# EAGLE design solenoid valve2 2019:9:15 (EAGLE 9.2.2)

## Sheet 1 of 5: photorelay0
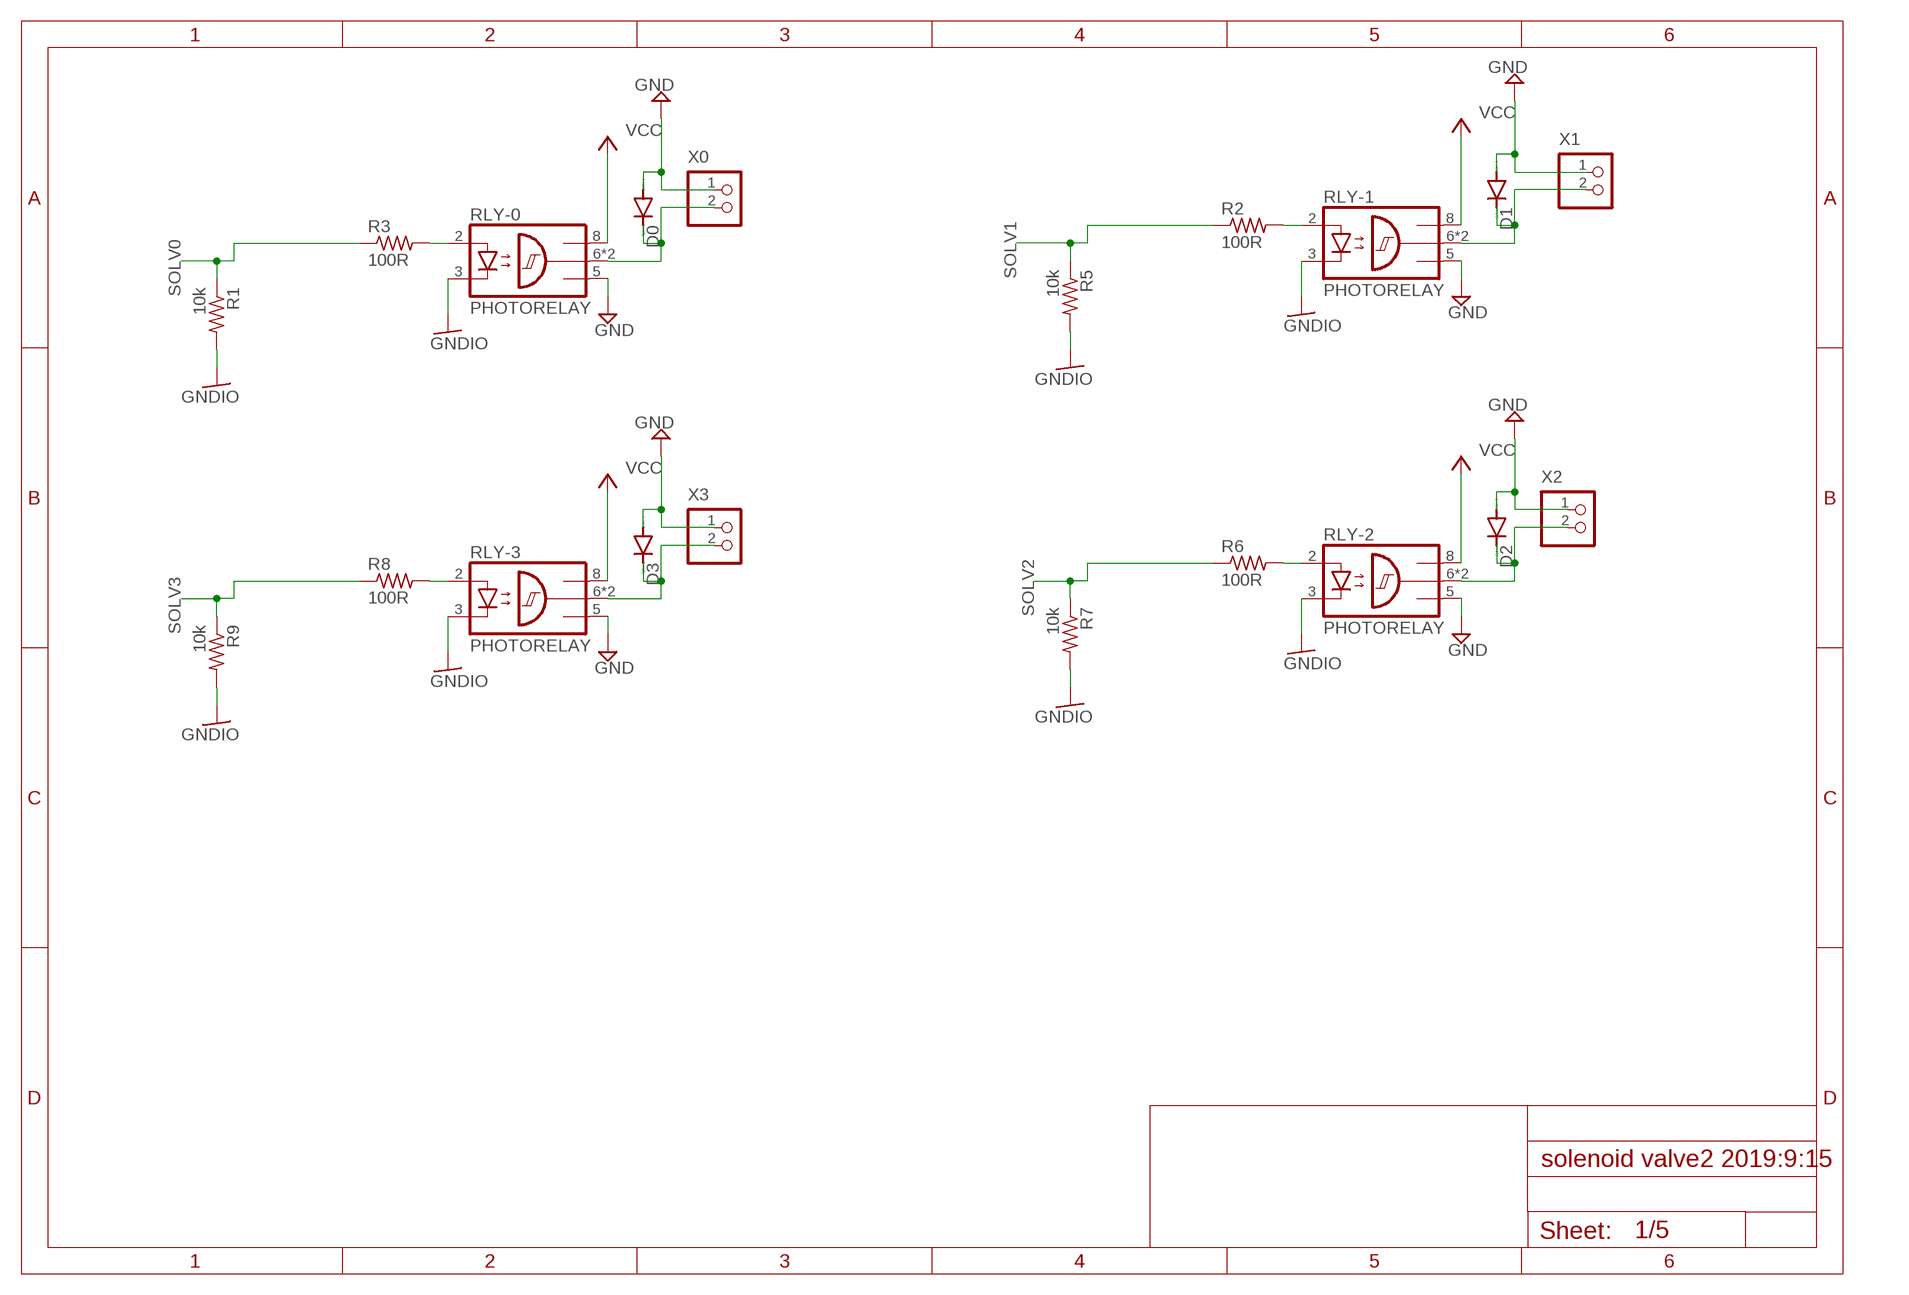
[diagram p0: schematic, sheet 1]

### Parts
D0  DIODE-SOD123  [SOD123]
D1  DIODE-SOD123  [SOD123]
D2  DIODE-SOD123  [SOD123]
D3  DIODE-SOD123  [SOD123]
R1  10k  R-US_R0603  [R0603]
R2  100R  R-US_R0603  [R0603]
R3  100R  R-US_R0603  [R0603]
R5  10k  R-US_R0603  [R0603]
R6  100R  R-US_R0603  [R0603]
R7  10k  R-US_R0603  [R0603]
R8  100R  R-US_R0603  [R0603]
R9  10k  R-US_R0603  [R0603]
RLY-0  PHOTORELAY  [SOP254P1016X385-8]
RLY-1  PHOTORELAY  [SOP254P1016X385-8]
RLY-2  PHOTORELAY  [SOP254P1016X385-8]
RLY-3  PHOTORELAY  [SOP254P1016X385-8]
X0  S2B-XASK-1  [S2B-XASK-1]
X1  S2B-XASK-1  [S2B-XASK-1]
X2  S2B-XASK-1  [S2B-XASK-1]
X3  S2B-XASK-1  [S2B-XASK-1]

### Nets
GND: D0.A D1.A D2.A D3.A RLY-0.5(GND) RLY-1.5(GND) RLY-2.5(GND) RLY-3.5(GND) X0.1 X1.1 X2.1 X3.1 ; also sheet 2
GNDIO: R1.2 R5.2 R7.2 R9.2 RLY-0.3(C) RLY-1.3(C) RLY-2.3(C) RLY-3.3(C) ; also sheet 2,3,4,5
N$1: D1.C RLY-1.6(OUT) RLY-1.7(OUT) X1.2
N$2: R2.2 RLY-1.2(A)
N$3: D0.C RLY-0.6(OUT) RLY-0.7(OUT) X0.2
N$5: D2.C RLY-2.6(OUT) RLY-2.7(OUT) X2.2
N$6: R3.2 RLY-0.2(A)
N$8: R6.2 RLY-2.2(A)
N$23: D3.C RLY-3.6(OUT) RLY-3.7(OUT) X3.2
N$24: R8.2 RLY-3.2(A)
SOLV0: R1.1 R3.1 ; also sheet 3
SOLV1: R2.1 R5.1 ; also sheet 3
SOLV2: R6.1 R7.1 ; also sheet 3
SOLV3: R8.1 R9.1 ; also sheet 3
VCC: RLY-0.8(VCC) RLY-1.8(VCC) RLY-2.8(VCC) RLY-3.8(VCC) ; also sheet 2

## Sheet 2 of 5: photorelay1
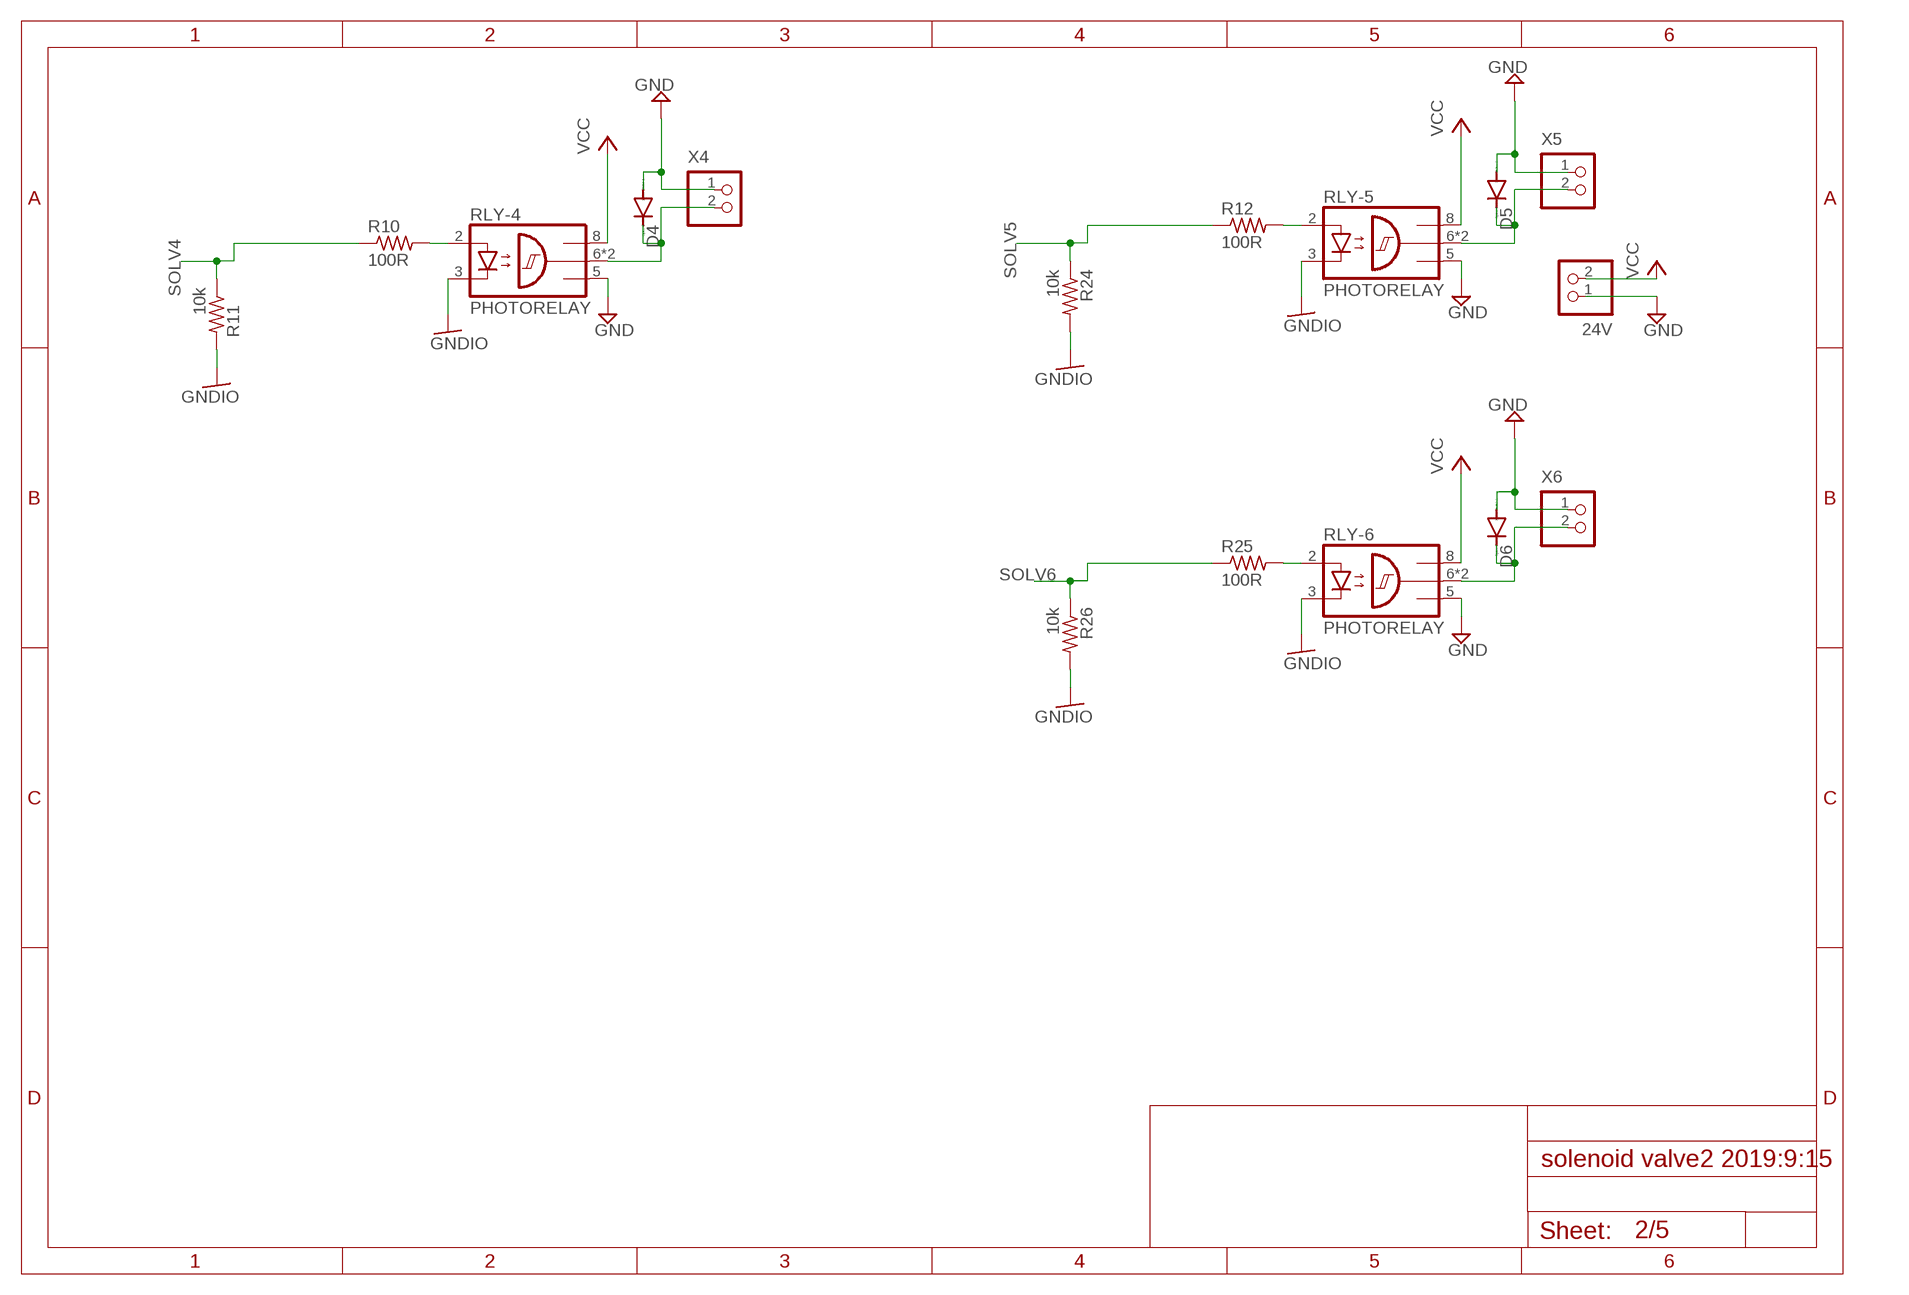
[diagram p1: schematic, sheet 2]

### Parts
24V  S2B-XASK-1  [S2B-XASK-1]
D4  DIODE-SOD123  [SOD123]
D5  DIODE-SOD123  [SOD123]
D6  DIODE-SOD123  [SOD123]
R10  100R  R-US_R0603  [R0603]
R11  10k  R-US_R0603  [R0603]
R12  100R  R-US_R0603  [R0603]
R24  10k  R-US_R0603  [R0603]
R25  100R  R-US_R0603  [R0603]
R26  10k  R-US_R0603  [R0603]
RLY-4  PHOTORELAY  [SOP254P1016X385-8]
RLY-5  PHOTORELAY  [SOP254P1016X385-8]
RLY-6  PHOTORELAY  [SOP254P1016X385-8]
X4  S2B-XASK-1  [S2B-XASK-1]
X5  S2B-XASK-1  [S2B-XASK-1]
X6  S2B-XASK-1  [S2B-XASK-1]

### Nets
GND: 24V.1 D4.A D5.A D6.A RLY-4.5(GND) RLY-5.5(GND) RLY-6.5(GND) X4.1 X5.1 X6.1 ; also sheet 1
GNDIO: R11.2 R24.2 R26.2 RLY-4.3(C) RLY-5.3(C) RLY-6.3(C) ; also sheet 1,3,4,5
N$26: D4.C RLY-4.6(OUT) RLY-4.7(OUT) X4.2
N$27: R10.2 RLY-4.2(A)
N$29: D5.C RLY-5.6(OUT) RLY-5.7(OUT) X5.2
N$30: R12.2 RLY-5.2(A)
N$32: D6.C RLY-6.6(OUT) RLY-6.7(OUT) X6.2
N$33: R25.2 RLY-6.2(A)
SOLV4: R10.1 R11.1 ; also sheet 3
SOLV5: R12.1 R24.1 ; also sheet 3
SOLV6: R25.1 R26.1 ; also sheet 3
VCC: 24V.2 RLY-4.8(VCC) RLY-5.8(VCC) RLY-6.8(VCC) ; also sheet 1

## Sheet 3 of 5: mcu
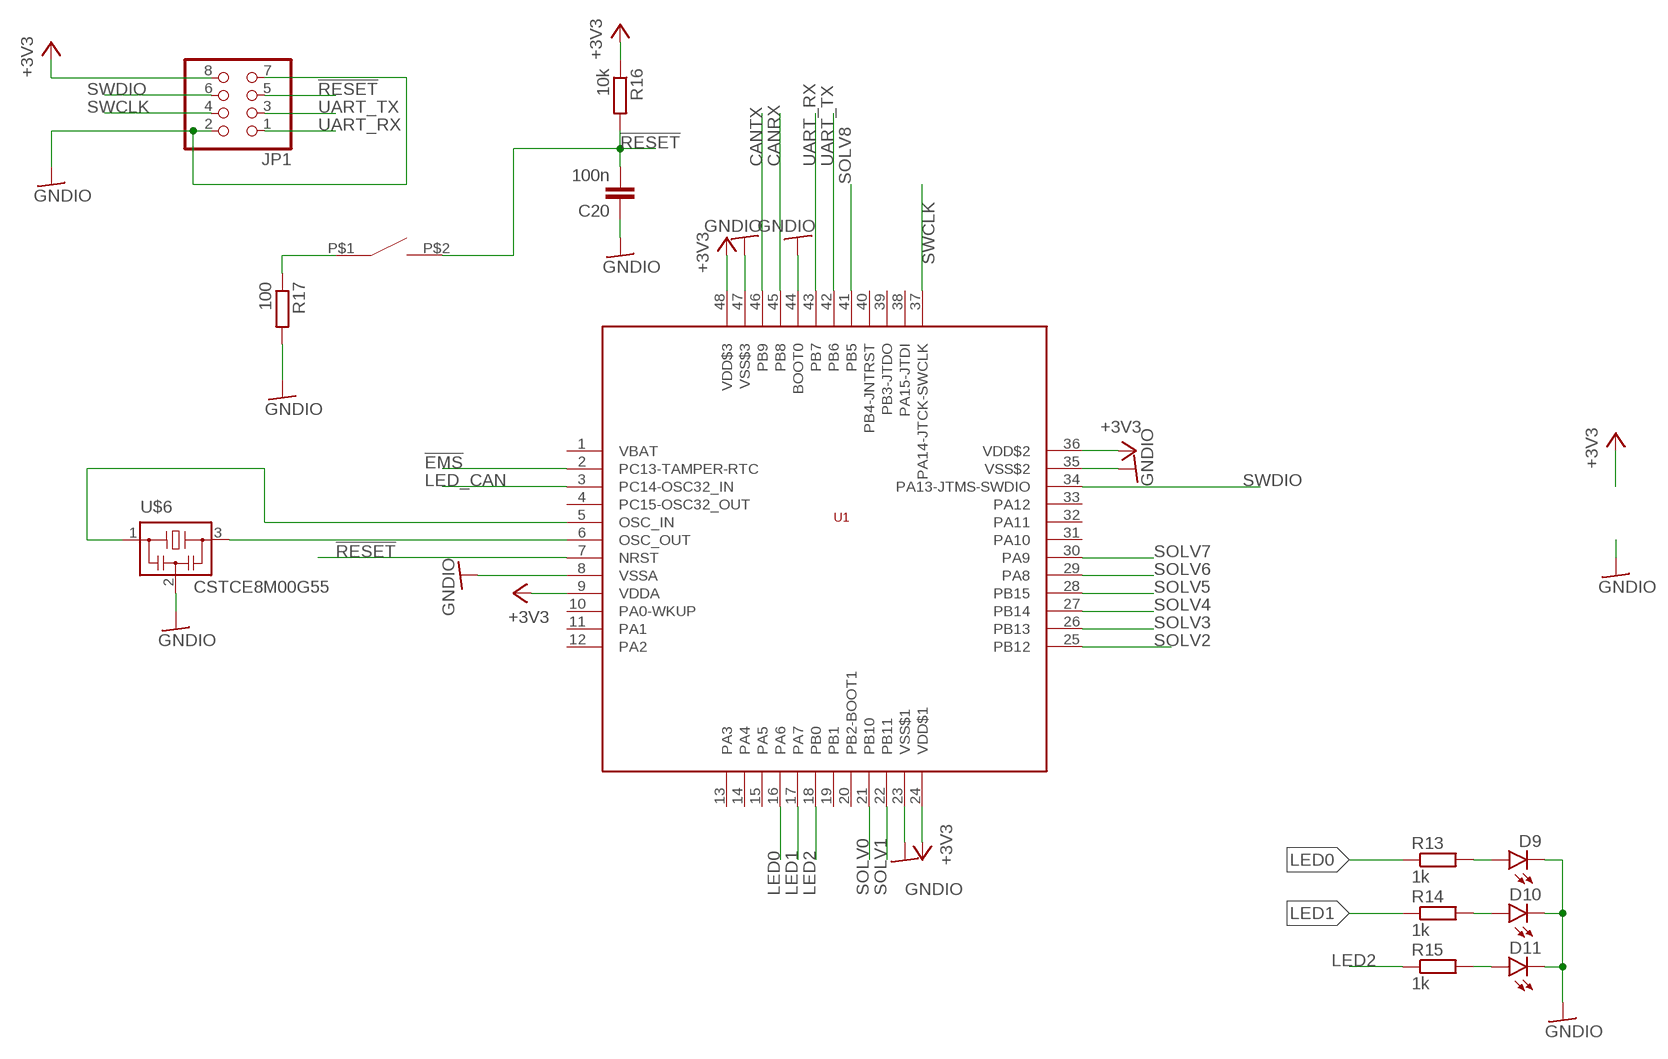
[diagram p2: schematic, sheet 3]

### Parts
C20  100n  C-EUC0603  [C0603]
D9  LEDCHIPLED_0805  [CHIPLED_0805]
D10  LEDCHIPLED_0805  [CHIPLED_0805]
D11  LEDCHIPLED_0805  [CHIPLED_0805]
JP1  PINHD-2X4/90  [2X04/90]
R13  1k  R-EU_R0603  [R0603]
R14  1k  R-EU_R0603  [R0603]
R15  1k  R-EU_R0603  [R0603]
R16  10k  R-EU_R0603  [R0603]
R17  100  R-EU_R0603  [R0603]
SW1  SWITCH_TACTILETOP  [SWITCH_TACTILE_3X6]
U1  STM32F103C8  [LQFP48]
U$6  CSTCE8M00G55  [CSTCE8M00G55]

### Nets
!EMS: U1.2(PC13-TAMPER-RTC) ; also sheet 4
!RESET: C20.2 JP1.5 R16.2 SW1.P$2 U1.7(NRST)
+3V3: JP1.8 R16.1 U1.9(VDDA) U1.24(VDD$1) U1.36(VDD$2) U1.48(VDD$3) ; also sheet 5
CANRX: U1.45(PB8) ; also sheet 4
CANTX: U1.46(PB9) ; also sheet 4
GNDIO: C20.1 D9.C D10.C D11.C JP1.2 JP1.7 R17.2 U1.8(VSSA) U1.23(VSS$1) U1.35(VSS$2) U1.44(BOOT0) U1.47(VSS$3) U$6.2 ; also sheet 1,2,4,5
LED0: R13.1 U1.16(PA6)
LED1: R14.1 U1.17(PA7)
LED2: R15.1 U1.18(PB0)
LED_CAN: U1.3(PC14-OSC32_IN) ; also sheet 4
N$9: D10.A R14.2
N$10: D9.A R13.2
N$11: U1.6(OSC_OUT) U$6.3
N$16: R17.1 SW1.P$1
N$19: U1.5(OSC_IN) U$6.1
N$21: D11.A R15.2
SOLV0: U1.21(PB10) ; also sheet 1
SOLV1: U1.22(PB11) ; also sheet 1
SOLV2: U1.25(PB12) ; also sheet 1
SOLV3: U1.26(PB13) ; also sheet 1
SOLV4: U1.27(PB14) ; also sheet 2
SOLV5: U1.28(PB15) ; also sheet 2
SOLV6: U1.29(PA8) ; also sheet 2
SOLV7: U1.30(PA9)
SOLV8: U1.41(PB5)
SWCLK: JP1.4 U1.37(PA14-JTCK-SWCLK)
SWDIO: JP1.6 U1.34(PA13-JTMS-SWDIO)
UART_RX: JP1.1 U1.43(PB7)
UART_TX: JP1.3 U1.42(PB6)
Unconnected: U1.1(VBAT) U1.4(PC15-OSC32_OUT) U1.10(PA0-WKUP) U1.11(PA1) U1.12(PA2) U1.13(PA3) U1.14(PA4) U1.15(PA5) U1.19(PB1) U1.20(PB2-BOOT1) U1.31(PA10) U1.32(PA11) U1.33(PA12) U1.38(PA15-JTDI) U1.39(PB3-JTDO) U1.40(PB4-JNTRST)

## Sheet 4 of 5: can
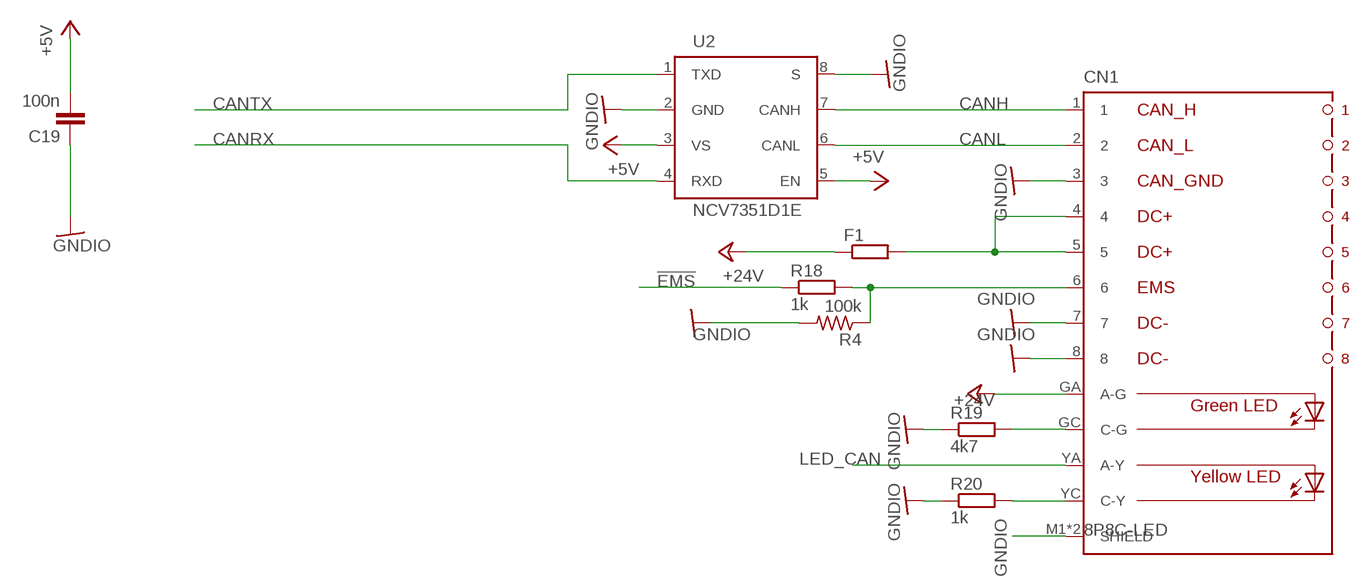
[diagram p3: schematic, sheet 4]

### Parts
C19  100n  C-EUC0603  [C0603]
CN1  8P8C-LED  [8P8C-LED]
F1  R-EU_R1206  [R1206]
R4  100k  R-US_R0603  [R0603]
R18  1k  R-EU_R0603  [R0603]
R19  4k7  R-EU_R0603  [R0603]
R20  1k  R-EU_R0603  [R0603]
U2  NCV7351D1E  [SO08]

### Nets
!EMS: R18.1 ; also sheet 3
+5V: C19.2 U2.3(VS) U2.5(EN) ; also sheet 5
+24V: CN1.GA(A-G) F1.1 ; also sheet 5
CANH: CN1.1 U2.7(CANH)
CANL: CN1.2 U2.6(CANL)
CANRX: U2.4(RXD) ; also sheet 3
CANTX: U2.1(TXD) ; also sheet 3
GNDIO: C19.1 CN1.3 CN1.7 CN1.8 CN1.M1(SHIELD) CN1.M2(SHIELD) R4.2 R19.1 R20.1 U2.2(GND) U2.8(S) ; also sheet 1,2,3,5
LED_CAN: CN1.YA(A-Y) ; also sheet 3
N$12: CN1.4 CN1.5 F1.2
N$18: CN1.YC(C-Y) R20.2
N$22: CN1.GC(C-G) R19.2
N$38: CN1.6 R4.1 R18.2

## Sheet 5 of 5: power suply
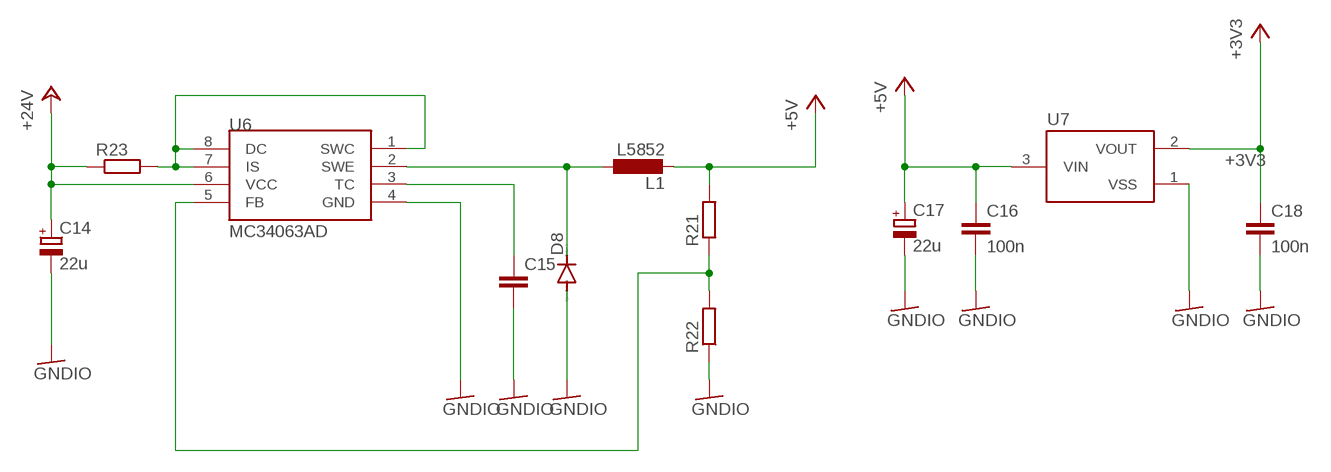
[diagram p4: schematic, sheet 5]

### Parts
C14  22u  CPOL-EUE2-5  [E2-5]
C15  C-EUC0603  [C0603]
C16  100n  C-EUC0603  [C0603]
C17  22u  CPOL-EUE2-5  [E2-5]
C18  100n  C-EUC0603  [C0603]
D8  DIODE-SOD123  [SOD123]
L1  L5852  [L5852]
R21  R-EU_R0603  [R0603]
R22  R-EU_R0603  [R0603]
R23  R-EU_R1206  [R1206]
U6  MC34063AD  [SOIC8]
U7  XC6206  [SOT95P240X110-3]

### Nets
+3V3: C18.1 U7.2(VOUT) ; also sheet 3
+5V: C16.1 C17.+ L1.P$2 R21.2 U7.3(VIN) ; also sheet 4
+24V: C14.+ R23.1 U6.6(VCC) ; also sheet 4
GNDIO: C14.- C15.2 C16.2 C17.- C18.2 D8.A R22.1 U6.4(GND) U7.1(VSS) ; also sheet 1,2,3,4
N$13: R23.2 U6.1(SWC) U6.7(IS) U6.8(DC)
N$14: D8.C L1.P$1 U6.2(SWE)
N$15: C15.1 U6.3(TC)
N$17: R21.1 R22.2 U6.5(FB)

## Library data of the parts
24V X0 X1-X6 = jst-xa:S2B-XASK-1: Wire-to-Board 2.5mm pitch top mount connector Source: http://www.jst-mfg.com/product/pdf/jpn/XA1.pdf http://www.jst-mfg.com/product/detail.php?series=272
C14 C17 = rcl:CPOL-EU: POLARIZED CAPACITOR, European symbol
C15 = rcl:C-EU: CAPACITOR, European symbol; SPICEPREFIX: C
C16 C18-C20 = rcl:C-EU: CAPACITOR, European symbol
CN1 = con-rj45:8P8C-LED: generic 8P8C connector with two LED's; OC_FARNELL: unknown; OC_NEWARK: unknown
D0 D1-D6 D8 = diode:DIODE-: DIODE
D9-D11 = led:LED: LED OSRAM: - CHIPLED LG R971, LG N971, LY N971, LG Q971, LY Q971, LO R971, LY R971 LH N974, LH R974 LS Q976, LO Q976, LY Q976 LO Q996 - Hyper CHIPLED LW Q18S LB Q993, LB Q99A, LB R99A - SideLED LS A670, LO A670, LY A670, LG A670, LP A670 LB A673, LV A673, LT A673, LW A673 LH A674 LY A675 LS A676, LA A676, LO A676, LY A676, LW A676 LS A679, LY A679, LG A679 - Hyper Micro SIDELED® LS Y876, LA Y876, LO Y876, LY Y876 LT Y87S - SmartLED LW L88C, LW L88S LB L89C, LB L89S, LG L890 LS L89K, LO L89K, LY L89K LS L896, LA L896, LO L896, LY L896 - TOPLED LS T670, LO T670, LY T670, LG T670, LP T670 LSG T670, LSP T670, LSY T670, LOP T670, LYG T670 LG T671, LOG T671, LSG T671 LB T673, LV T673, LT T673, LW T673 LH T674 LS T676, LA T676, LO T676, LY T676, LB T676, LH T676, LSB T676, LW T676 LB T67C, LV T67C, LT T67C, LS T67K, LO T67K, LY T67K, LW E67C LS E67B, LA E67B, LO E67B, LY E67B, LB E67C, LV E67C, LT E67C LW T67C LS T679, LY T679, LG T679 LS T770, LO T770, LY T770, LG T770, LP T770 LB T773, LV T773, LT T773, LW T773 LH T774 LS E675, LA E675, LY E675, LS T675 LS T776, LA T776, LO T776, LY T776, LB T776 LHGB T686 LT T68C, LB T68C - Hyper Mini TOPLED® LB M676 - Mini TOPLED Santana® LG M470 LS M47K, LO M47K, LY M47K Source: http://www.osram.convergy.de LUXEON: - LUMILED® LXK2-PW12-R00, LXK2-PW12-S00, LXK2-PW14-U00, LXK2-PW14-V00 LXK2-PM12-R00, LXK2-PM12-S00, LXK2-PM14-U00 LXK2-PE12-Q00, LXK2-PE12-R00, LXK2-PE12-S00, LXK2-PE14-T00, LXK2-PE14-U00 LXK2-PB12-K00, LXK2-PB12-L00, LXK2-PB12-M00, LXK2-PB14-N00, LXK2-PB14-P00, LXK2-PB14-Q00 LXK2-PR12-L00, LXK2-PR12-M00, LXK2-PR14-Q00, LXK2-PR14-R00 LXK2-PD12-Q00, LXK2-PD12-R00, LXK2-PD12-S00 LXK2-PH12-R00, LXK2-PH12-S00 LXK2-PL12-P00, LXK2-PL12-Q00, LXK2-PL12-R00 Source: www.luxeon.com KINGBRIGHT: KA-3528ASYC Source: www.kingbright.com
F1 R18-R23 = rcl:R-EU_: RESISTOR, European symbol; SPICEPREFIX: R
JP1 = pinhead:PINHD-2X4: PIN HEADER
L1 = l_ysk:L5852
R1-R12 R24-R26 = rcl:R-US_: RESISTOR, American symbol; SPICEPREFIX: R
R13-R17 = rcl:R-EU_: RESISTOR, European symbol
RLY-0 RLY-1-RLY-6 = opto-coupler:PHOTORELAY
SW1 = switch-tactile:SWITCH_TACTILE
U1 = stm32_mcu:STM32F103C8: STMicroelectronics STM32F103C8 Mainstream Performance line, ARM Cortex-M3 MCU with 64 Kbytes Flash, 72 MHz CPU, motor control, USB and CAN references: datasheet <https://www.st.com/resource/en/datasheet/stm32f103c8.pdf> product page <https://www.st.com/ja/microcontrollers/stm32f103c8.html>
U2 = on-semi:NCV7351D1E: High Speed CAN Transceiver Source: NCV7351-D.PDF <http://www.onsemi.com/PowerSolutions/document/NCV7351-D.PDF>
U6 = mc34063:MC34063
U7 = torex:XC6206
U$6 = resonator:CSTCE8M00G55

## Board
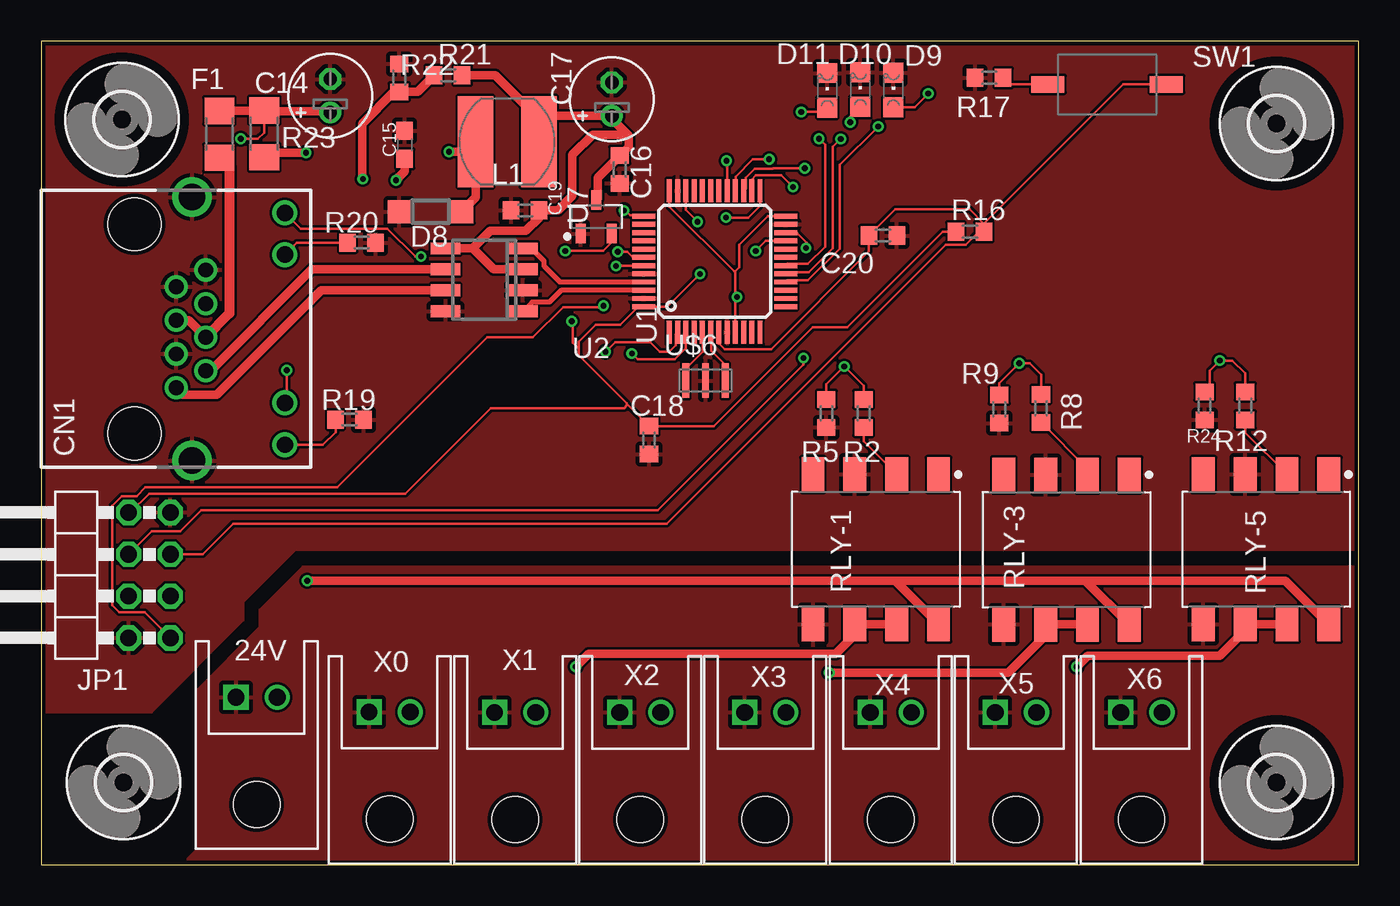
[diagram p5: board, top side]
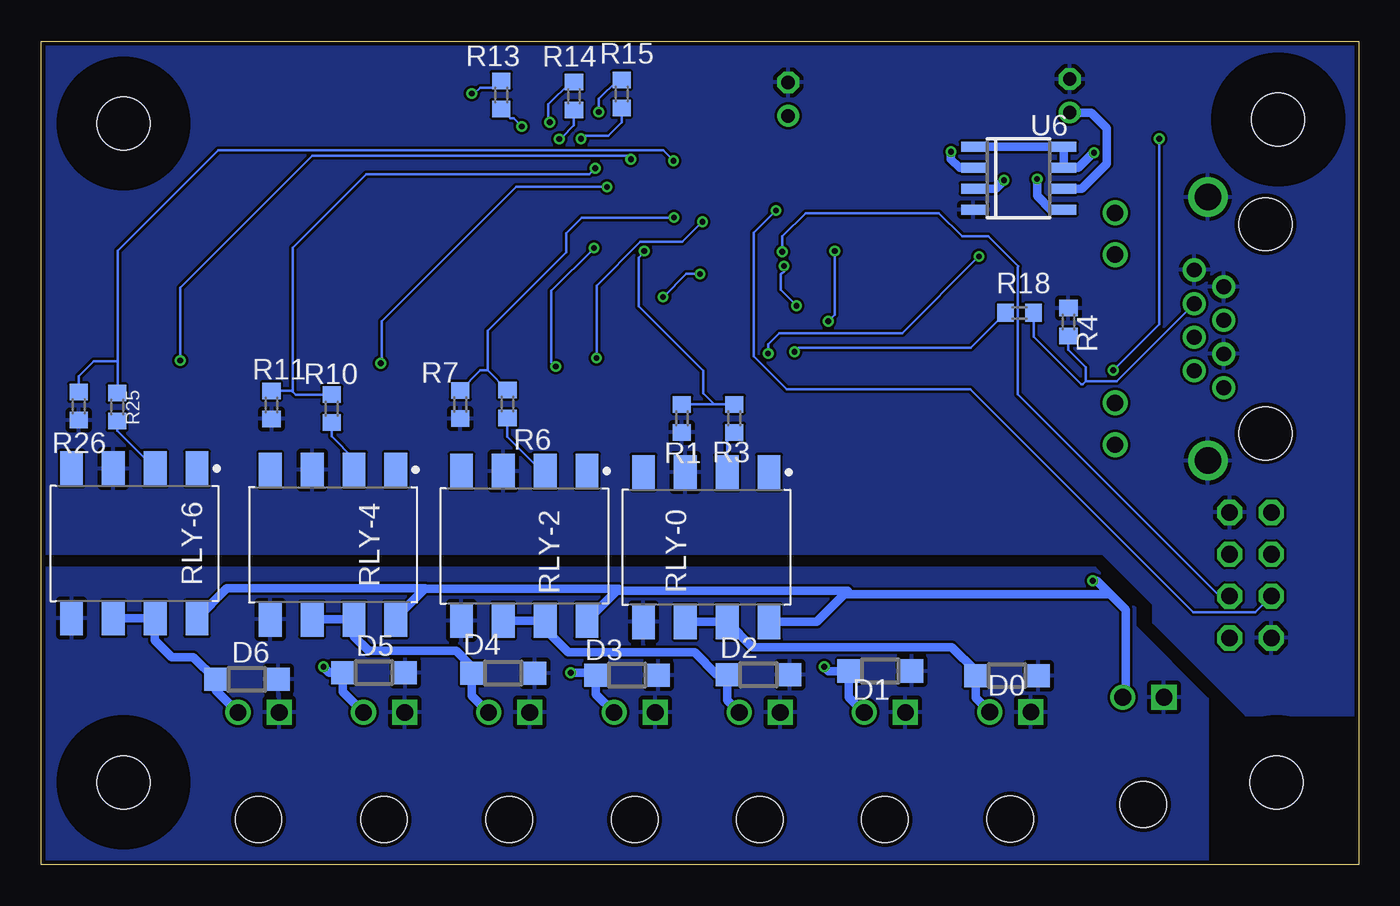
[diagram p6: board, bottom side, seen from below]

Size 80 x 50 mm. Coordinates in mm from the lower left corner, seen from the top.
Outline: 0,0 80,0 80,50 0,50 0,0
Copper layers (1*16): Top 0.035mm / dielectric 1.5mm / Bottom 0.035mm
Design rules "SeeedStudio_2layer_DRU_no_angle_20140221": minimum track width 6mil, minimum drill 12mil, track to track 6mil, track to pad 6mil, pad to pad 6mil, via to via 6mil, smd to smd 0mil, copper to edge 10mil, drill to drill 10mil, minimum pad ring 10mil, minimum via ring 6mil, stop-mask expansion 2mil, vias tented up to drill 100mil, thermal gap 10mil

### Footprints (pad centres in the part's own frame; a part is rotated, then mirrored left to right if it is on the bottom)
S2B-XASK-1 = drill 1.016 square: 1 1.25,0 | drill 1.016: 2 -1.25,0 | hole 2.8: 0,6.5
E2-5 = drill 0.813 pad 1.27: + -1.016,0 | drill 0.813 pad 1.27 octagon: - 1.016,0
C0603 = smd 1.1 x 1: 1 -0.85,0; 2 0.85,0
C0603' = smd 1 x 1.1: 1 -0.85,0; 2 0.85,0
8P8C-LED = drill 0.9 pad 1.3: 1 3.57,-3.81; 2 2.55,-2.03; 3 1.53,-3.81; 4 0.51,-2.03; 5 -0.51,-3.81; 6 -1.53,-2.03; 7 -2.55,-3.81; 8 -3.57,-2.03 | drill 1 pad 1.422: GA 4.5,2.78; GC 7.04,2.78; YA -7.04,2.78; YC -4.5,2.78 | drill 1.6 pad 2.184: M1 -8,-2.85; M2 8,-2.85 | hole 3.2: 6.35,-6.35; -6.35,-6.35
SOD123 = smd 1.4 x 1.4: A 1.9,0; C -1.9,0
CHIPLED_0805 = smd 1.2 x 1.2: A 0,-1.05; C 0,1.05
R1206 = smd 1.6 x 1.803: 1 -1.422,0; 2 1.422,0
2X04/90 = drill 1.016 octagon: 1 -3.81,-6.35; 2 -3.81,-3.81; 3 -1.27,-6.35; 4 -1.27,-3.81; 5 1.27,-6.35; 6 1.27,-3.81; 7 3.81,-6.35; 8 3.81,-3.81
L5852 = smd 2.15 x 5.5: P$1 1.925,0; P$2 -1.925,0
R0603 = smd 1 x 1.1: 1 -0.85,0; 2 0.85,0
SOP254P1016X385-8 = smd 2.09 x 1.389: 1 -4.54,3.81; 2 -4.54,1.27; 3 -4.54,-1.27; 4 -4.54,-3.81; 5 4.54,-3.81; 6 4.54,-1.27; 7 4.54,1.27; 8 4.54,3.81
SWITCH_TACTILE_3X6 = smd 2 x 1: P$1 -3.6,0; P$2 3.6,0
LQFP48 = smd 1.4 x 0.3: 1 -4.3,2.75; 2 -4.3,2.25; 3 -4.3,1.75; 4 -4.3,1.25; 5 -4.3,0.75; 6 -4.3,0.25; 7 -4.3,-0.25; 8 -4.3,-0.75; 9 -4.3,-1.25; 10 -4.3,-1.75; 11 -4.3,-2.25; 12 -4.3,-2.75; 25 4.3,-2.75; 26 4.3,-2.25; 27 4.3,-1.75; 28 4.3,-1.25; 29 4.3,-0.75; 30 4.3,-0.25; 31 4.3,0.25; 32 4.3,0.75; 33 4.3,1.25; 34 4.3,1.75; 35 4.3,2.25; 36 4.3,2.75 | smd 0.3 x 1.4: 13 -2.75,-4.3; 14 -2.25,-4.3; 15 -1.75,-4.3; 16 -1.25,-4.3; 17 -0.75,-4.3; 18 -0.25,-4.3; 19 0.25,-4.3; 20 0.75,-4.3; 21 1.25,-4.3; 22 1.75,-4.3; 23 2.25,-4.3; 24 2.75,-4.3; 37 2.75,4.3; 38 2.25,4.3; 39 1.75,4.3; 40 1.25,4.3; 41 0.75,4.3; 42 0.25,4.3; 43 -0.25,4.3; 44 -0.75,4.3; 45 -1.25,4.3; 46 -1.75,4.3; 47 -2.25,4.3; 48 -2.75,4.3
SO08 = smd 0.72 x 1.78: 1 -1.905,-2.35; 2 -0.635,-2.35; 3 0.635,-2.35; 4 1.905,-2.35; 5 1.905,2.35; 6 0.635,2.35; 7 -0.635,2.35; 8 -1.905,2.35
SOIC8 = smd 0.6 x 1.5: 1 -1.905,-2.75; 2 -0.635,-2.75; 3 0.635,-2.75; 4 1.905,-2.75; 5 1.905,2.75; 6 0.635,2.75; 7 -0.635,2.75; 8 -1.905,2.75
SOT95P240X110-3 = smd 1.18 x 0.609: 1 -1.024,0.95; 2 -1.024,-0.95; 3 1.024,0
3,2 = hole 3.2: 0,0
CSTCE8M00G55 = smd 0.4 x 2.1: 1 -1.2,0; 2 0,0; 3 1.2,0

### Placement (x,y rotation side)
24V  13.08,10.16 180 top
C14  17.55,46.69 90 top
C15  22.07,43.71 90 top
C16  100n  [C0603']  35.13,42.21 270 top
C17  34.65,46.48 90 top
C18  100n  [C0603']  36.91,25.78 270 top
C19  100n  [C0603']  29.39,39.73 0 top
C20  100n  [C0603']  51.1,38.2 180 top
CN1  12.01,32.54 270 top
D0  21.36,11.48 0 bottom
D1  29.06,11.76 0 bottom
D2  36.45,11.53 0 bottom
D3  44.42,11.51 0 bottom
D4  51.94,11.63 0 bottom
D5  59.79,11.66 0 bottom
D6  67.51,11.25 0 bottom
D8  23.65,39.65 180 top
D9  51.74,47.04 0 top
D10  49.73,47.07 0 top
D11  47.73,47.02 0 top
F1  10.82,44.35 270 top
JP1  1.5,17.58 90 top
L1  28.3,43.89 180 top
R1  41.1,27.1 270 bottom
R2  49.94,27.41 270 top
R3  37.92,27.1 270 bottom
R4  17.63,32.94 90 bottom
R5  47.68,27.41 270 top
R6  51.69,27.97 270 bottom
R7  54.56,27.94 270 bottom
R8  60.71,27.71 270 top
R9  58.17,27.66 270 top
R10  62.36,27.69 270 bottom
R11  66.01,27.91 270 bottom
R12  73.1,27.86 270 top
R13  52.07,46.74 90 bottom
R14  47.65,46.66 90 bottom
R15  44.75,46.79 90 bottom
R16  56.39,38.43 0 top
R17  57.56,47.78 180 top
R18  20.6,33.5 0 bottom
R19  18.72,27.03 180 top
R20  19.46,37.77 180 top
R21  24.71,47.93 0 top
R22  21.74,47.78 270 top
R23  13.54,44.37 270 top
R24  70.64,27.86 270 top
R25  75.39,27.79 270 bottom
R26  77.72,27.84 270 bottom
RLY-0  39.62,19.28 270 bottom
RLY-1  50.67,19.15 270 top
RLY-2  50.67,19.35 270 bottom
RLY-3  62.26,19.13 270 top
RLY-4  62.28,19.43 270 bottom
RLY-5  74.37,19.15 270 top
RLY-6  74.35,19.51 270 bottom
SW1  64.72,47.37 0 top
U1  40.89,36.63 90 top
U2  26.9,35.51 90 top
U6  20.65,41.68 270 bottom
U7  33.71,39.34 90 top
U$1  [3,2]  5,5 0 top
U$2  [3,2]  4.9,45.24 0 top
U$3  [3,2]  75,45 0 top
U$4  [3,2]  75,5 0 top
U$6  40.34,29.39 0 top
X0  21.16,9.27 180 top
X1  28.78,9.25 180 top
X2  36.37,9.25 180 top
X3  43.97,9.25 180 top
X4  51.59,9.25 180 top
X5  59.18,9.25 180 top
X6  66.8,9.25 180 top

### Tracks (layer width: path | path; a pad name or v marks a point on that pad's centre or on a via)
!EMS  (via drill 0.35)
  Top 0.152: v34.27,31.14 34.85,31.73 36.98,31.73 37.57,31.14 38.13,31.14 38.52,31.53 38.52,32.2 U1.2
  Bottom 0.152: v34.27,31.14 34.01,31.39 23.56,31.39 R18.1
!RESET
  Top 0.152: U1.7 41.14,31.64 41.16,31.64 41.5,31.29 44.31,31.29 50.26,37.24 C20.2 51.85,39.8 56.36,39.8 57.24,38.93 | 57.24,38.93 R16.2 57.32,38.35 56.83,38.35 56.13,37.65 54.94,37.65 37.98,20.7 11.66,20.7 9.8,18.85 JP1.5 | 57.24,38.93 65.68,47.37 SW1.P$2
+3V3  (via drill 0.35)
  Top 0.152: U1.36 38.14,39.95 42.08,36.02 42.14,36.02 | v40.01,35.87 38.02,33.88 U1.48 36.24,33.88 35.15,32.79 33.68,32.79 32.63,31.74 32.63,31.34 | v31.83,37.26 34.11,37.26 34.66,37.8 U7.2 | R16.1 54.73,38.43 48.93,32.63 46.85,32.63 40.84,26.63 C18.1 35.56,27.98 | 42.14,36.02 42.14,34.57 v42.24,34.47 42.14,34.37 U1.9 | 42.14,36.02 42.39,36.27 42.39,37.64 44.13,39.38 U1.24 | 35.56,27.98 35.56,27.89 35.39,27.72 27.29,27.72 22.1,22.53 6.55,22.53 5.41,21.39 JP1.8 | 32.63,31.34 32.27,31.7 32.27,32.94 v32.22,32.99 | 32.63,31.34 32.63,30.94 35.56,28.02 35.56,27.98
  Bottom 0.152: v42.24,34.47 40.84,35.87 v40.01,35.87 | v31.83,37.26 31.83,33.38 v32.22,32.99
+5V
  Top 0.508: R21.2 27.57,47.93 30.22,45.28 L1.P$2 30.22,45.47 C17.+ 34.65,45.29 35.61,44.32 | U7.3 33.78,40.45 33.78,41.69 35.13,43.04 C16.1 35.66,43.6 35.66,44.27 35.61,44.32 | 26.2,37.41 27.47,36.14 U2.3 | U2.5 26.2,37.41 | 26.2,37.41 27.27,38.48 29.43,38.48 30.24,39.29 C19.2 31.38,39.73 32.26,40.6 32.26,43.1 33.48,44.32 35.61,44.32
+24V  (via drill 0.35)
  Top 0.152: R23.1 13.54,44.45 13.16,44.07 v12.12,44.07 | v14.91,30.02 14.91,28.15 CN1.GA
  Top 0.508: F1.1 13.51,45.77 R23.1 13.59,45.74 17.48,45.74 C14.+
  Bottom 0.152: v12.12,44.07 12.12,32.82 v14.91,30.02
  Bottom 0.508: U6.6 16.81,41.05 15.3,42.56 15.3,44.71 16.26,45.67 C14.+
CANH
  Top 0.508: U2.7 17,34.87 10.67,28.55 8.62,28.55 CN1.1
CANL
  Top 0.508: CN1.2 10.29,29.99 16.44,36.14 U2.6
CANRX
  Top 0.305: U1.45 31.5,35.38 30.53,36.35 30.53,36.65 29.76,37.41 U2.4
CANTX
  Top 0.305: U1.46 31.56,34.88 30.85,34.16 29.81,34.16 U2.1
GND
  pour Top: 9.37,0.86 9.37,10.54 13.28,14.45 13.28,15.49 15.88,18.08 80.16,18.08 80.16,-0.1 8.41,-0.1
  pour Bottom: 9.17,-0.2 9.17,10.08 13.59,14.5 13.59,15.61 16.02,18.03 80.06,18.03 80.06,-0.33 79.91,-0.48 9.45,-0.48
GNDIO
  pour Top: 0,50.04 0,9.27 6.71,9.27 12.27,14.83 12.27,15.93 15.47,19.13 80.06,19.13 80.06,49.91 79.88,50.09 0.05,50.09
  pour Bottom: 0,49.89 0,9.07 6.86,9.07 12.47,14.68 12.47,15.78 15.57,18.87 80.01,18.87 80.01,50.04 0.15,50.04
LED0  (via drill 0.35)
  Top 0.152: v50.81,44.82 48.48,42.48 48.48,37.4 46.55,35.47 45.29,35.47 U1.16
  Bottom 0.152: R13.1 51.51,45.33 51.32,45.33 v50.81,44.82
LED1  (via drill 0.35)
  Top 0.152: U1.17 45.29,35.97 46.6,35.97 48.06,37.44 48.06,43.58 v48.54,44.06
  Bottom 0.152: R14.1 47.65,44.9 48.41,44.14 48.47,44.14 v48.54,44.06
LED2  (via drill 0.35)
  Top 0.152: U1.18 45.29,36.47 46.55,36.47 47.6,37.52 47.6,43.7 v47.22,44.08
  Bottom 0.152: R15.1 44.76,45.07 45.57,44.26 47.04,44.26 v47.22,44.08
LED_CAN  (via drill 0.35)
  Top 0.152: CN1.YA 15.76,38.61 21.02,38.61 22.71,36.93 v23.06,36.93 | U1.3 39.14,31.36 38.47,30.68 36.22,30.68 v35.87,31.04
  Bottom 0.152: v35.87,31.04 35.87,31.6 35.18,32.28 27.71,32.28 v23.06,36.93
N$1  (via drill 0.35)
  Top 0.508: v32.46,12.01 33.25,12.8 48.25,12.8 49.4,13.95 RLY-1.6 RLY-1.7
  Bottom 0.508: v32.46,12.01 32.21,11.76 D1.C 30.96,10.18 X1.2
N$2
  Top 0.152: R2.2 49.94,25.7 RLY-1.2
N$3
  Bottom 0.508: RLY-0.6 RLY-0.7 36.83,13.21 24.7,13.21 23.26,11.78 D0.C 23.26,10.12 X0.2
N$5
  Bottom 0.508: RLY-2.6 RLY-2.7 49.4,14.28 48.01,12.88 40.32,12.88 38.97,11.53 D2.C 38.35,9.97 X2.2
N$6
  Bottom 0.152: RLY-0.2 38.35,25.82 R3.2
N$8
  Bottom 0.152: R6.2 51.69,25.98 49.61,23.89 RLY-2.2
N$9  (via drill 0.35)
  Top 0.152: D10.A 49.12,45.41 v49.12,45.07
  Bottom 0.152: R14.2 47.85,47.51 49.2,46.16 49.2,45.15 v49.12,45.07
N$10  (via drill 0.35)
  Top 0.152: D9.A 53.04,45.99 53.85,46.8 v53.85,46.83
  Bottom 0.152: R13.2 52.07,47.19 53.34,47.19 53.7,46.83 v53.85,46.83
N$11
  Top 0.152: U$6.3 41.53,30.35 40.67,31.22 40.67,32.3 U1.6
N$12
  Top 0.508: CN1.4 8.96,33.05 CN1.5
  Top 0.61: F1.2 11.43,42.32 11.43,33.47 CN1.4
N$13  (via drill 0.35)
  Top 0.508: R23.2 13.82,43.23 v16.08,43.23
  Bottom 0.508: v16.08,43.23 16.12,43.23 17.04,42.32 U6.7 U6.8 U6.1
N$14  (via drill 0.35)
  Top 0.508: v24.77,43.28 25.76,43.28 L1.P$1 26.37,40.52 25.55,39.7 D8.C
  Bottom 0.508: v24.77,43.28 24.77,42.84 24.24,42.32 U6.2
N$15  (via drill 0.35)
  Top 0.508: C15.1 22.07,42.09 v21.54,41.55
  Bottom 0.508: U6.3 22.05,41.05 v21.54,41.55
N$16
  Top 0.152: SW1.P$1 58.81,47.37 R17.1
N$17  (via drill 0.35)
  Top 0.508: R21.1 22.86,46.93 R22.2 21.41,46.93 19.48,45 19.48,41.68 v19.53,41.63
  Bottom 0.508: U6.5 18.69,39.78 19.53,40.62 v19.53,41.63
N$18
  Top 0.152: CN1.YC 15.53,37.77 R20.2
N$19
  Top 0.152: U$6.1 39.13,30.12 40.16,31.14 40.16,32.31 U1.5
N$21  (via drill 0.35)
  Top 0.152: v46.15,45.71 47.47,45.71 D11.A
  Bottom 0.152: R15.2 45.01,47.64 46.15,46.5 v46.15,45.71
N$22
  Top 0.152: R19.2 17.87,26.26 17.1,25.5 CN1.GC
N$23  (via drill 0.35)
  Top 0.508: RLY-3.7 RLY-3.6 60.98,13.93 58.72,11.66 v47.85,11.66
  Bottom 0.508: v47.85,11.66 46.48,11.66 D3.C 46.33,10.35 X3.2
N$24
  Top 0.152: R8.2 63.52,24.04 RLY-3.2
N$26
  Bottom 0.508: RLY-4.6 RLY-4.7 61.01,13.88 60.12,12.99 54.8,12.99 53.84,12.03 D4.C 53.84,10.25 X4.2
N$27
  Bottom 0.152: R10.2 62.36,26 61.01,24.66 RLY-4.2
N$29  (via drill 0.35)
  Top 0.508: v62.87,12.01 63.53,12.68 71.55,12.68 73.1,14.23 RLY-5.6 RLY-5.7
  Bottom 0.508: v62.87,12.01 62.51,11.66 D5.C 61.69,10.51 X5.2
N$30
  Top 0.152: R12.2 73.1,26.23 RLY-5.2
N$32
  Bottom 0.152: 73.1,14.97 RLY-6.7
  Bottom 0.508: 73.1,14.97 73.1,13.62 72.08,12.6 70.76,12.6 D6.C 69.41,10.61 X6.2 | RLY-6.7 RLY-6.6
N$33
  Bottom 0.152: R25.2 75.39,26.36 RLY-6.2
N$38
  Bottom 0.152: CN1.6 14.7,29.36 16.59,29.36 | R4.1 17.63,31.26 16.59,30.21 16.59,29.36 | R18.2 19.75,32.07 16.86,29.18 16.76,29.18 16.59,29.36
SOLV0  (via drill 0.35)
  Top 0.152: U1.21 44,37.88 v43.38,37.26
  Bottom 0.152: v43.38,37.26 43.38,37.19 43.71,36.85 43.71,33.91 39.8,30 39.8,28.61 39.14,27.95 | R1.1 39.14,27.95 | R3.1 39.14,27.95
SOLV1  (via drill 0.35)
  Top 0.152: R2.1 49.94,29.07 v48.76,30.25 47.68,29.17 R5.1 | v46.43,37.44 46.48,37.49 46.48,37.77 45.87,38.38 U1.22
  Bottom 0.152: v46.43,37.44 49.02,34.85 49.02,30.52 v48.76,30.25
SOLV2  (via drill 0.35)
  Top 0.152: U1.25 43.64,40.01 42.92,39.29 v41.58,39.29
  Bottom 0.152: 52.88,30.01 R6.1 | v41.58,39.29 47.16,39.29 48.11,38.35 48.11,37.2 52.88,32.42 52.88,30.01 | 52.88,30.01 53.34,30.01 R7.1
SOLV3  (via drill 0.35)
  Top 0.152: R8.1 60.71,29.76 60.02,30.44 v59.38,30.44 58.17,29.22 R9.1 | v45.64,41.15 44.94,41.85 43.4,41.85 43.14,41.59 U1.26
  Bottom 0.152: v59.38,30.44 59.31,30.52 59.31,33.01 51.17,41.15 v45.64,41.15
SOLV4  (via drill 0.35)
  Top 0.152: U1.27 42.77,41.05 42.77,41.72 43.31,42.27 44.43,42.27 44.45,42.29 v46.35,42.29
  Bottom 0.152: v46.35,42.29 46.71,41.94 60.25,41.94 64.72,37.47 64.72,28.77 | R11.1 64.72,28.77 | R10.1 64.54,28.54 64.72,28.71 64.72,28.77
SOLV5  (via drill 0.35)
  Top 0.152: U1.28 42.16,40.95 42.16,41.77 43.22,42.82 v44.2,42.82 | R12.1 73.1,29.83 72.33,30.61 v71.55,30.61 70.94,30 70.94,29.02 R24.1
  Bottom 0.152: v44.2,42.82 44.42,43.05 63.53,43.05 71.55,35.03 v71.55,30.61
SOLV6  (via drill 0.35)
  Top 0.152: v41.6,42.75 41.64,42.71 U1.29
  Bottom 0.152: v41.6,42.75 42.24,43.38 69.24,43.38 75.36,37.26 75.36,30.61 | 75.36,30.61 75.36,28.66 R25.1 | 75.36,30.61 75.41,30.56 76.81,30.56 77.72,29.64 R26.1
SWCLK  (via drill 0.35)
  Top 0.152: v35.38,39.73 35.46,39.73 35.76,39.42 36.55,39.42 U1.37
  Bottom 0.152: v35.38,39.73 36.73,38.38 36.73,30.86 34.72,28.86 23.59,28.86 10.04,15.32 6.3,15.32 JP1.4
SWDIO  (via drill 0.35)
  Top 0.152: U1.34 39.14,39.75 v39.85,39.04 | v46.28,30.76 46.28,30.35 37.44,21.51 9.73,21.51 8.46,20.24 6.71,20.24 JP1.6
  Bottom 0.152: v39.85,39.04 41.08,37.82 43.61,37.82 46.28,35.15 v46.28,30.76
UART_RX  (via drill 0.35)
  Top 0.152: v34.14,33.93 34.06,33.86 31.69,33.86 29.86,32.02 27.08,32.02 17.96,22.91 6.33,22.91 5.79,22.38 4.9,22.38 4.32,21.8 4.32,15.75 4.75,15.31 6.3,15.31 JP1.1 | v34.9,36.35 34.93,36.38 U1.43
  Bottom 0.152: v34.14,33.93 35.1,34.9 35.1,35.84 34.9,36.04 v34.9,36.35
UART_TX  (via drill 0.35)
  Top 0.152: v35,37.21 35.59,37.21 35.92,36.88 U1.42
  Bottom 0.152: v35,37.21 35,38.15 33.58,39.57 25.5,39.57 24.09,38.16 22.51,38.16 20.68,36.32 20.72,36.28 20.72,28.57 8.46,16.31 JP1.3
VCC  (via drill 0.35)
  Top 0.508: v16.15,17.25 51.85,17.25 | 51.85,17.25 RLY-1.8 | 51.85,17.25 63.41,17.25 | 63.41,17.25 75.55,17.25 RLY-5.8 | 63.41,17.25 RLY-3.8
  Bottom 0.508: 15.1,16.42 14.15,15.47 14.15,10.34 24V.2 | v16.15,17.25 15.93,17.25 15.1,16.42 | 15.1,16.42 31.24,16.42 | 45.05,16.62 31.04,16.62 31.24,16.42 | 45.05,16.62 44.93,16.75 56.71,16.75 | 45.05,16.62 RLY-2.8 | RLY-4.8 58.47,14.99 56.71,16.75 | 56.71,16.75 56.69,16.78 68.73,16.78 RLY-6.8 | RLY-0.8 32.92,14.74 31.24,16.42